# EAGLE design sensorAndTransmitter (EAGLE 8.0.2)
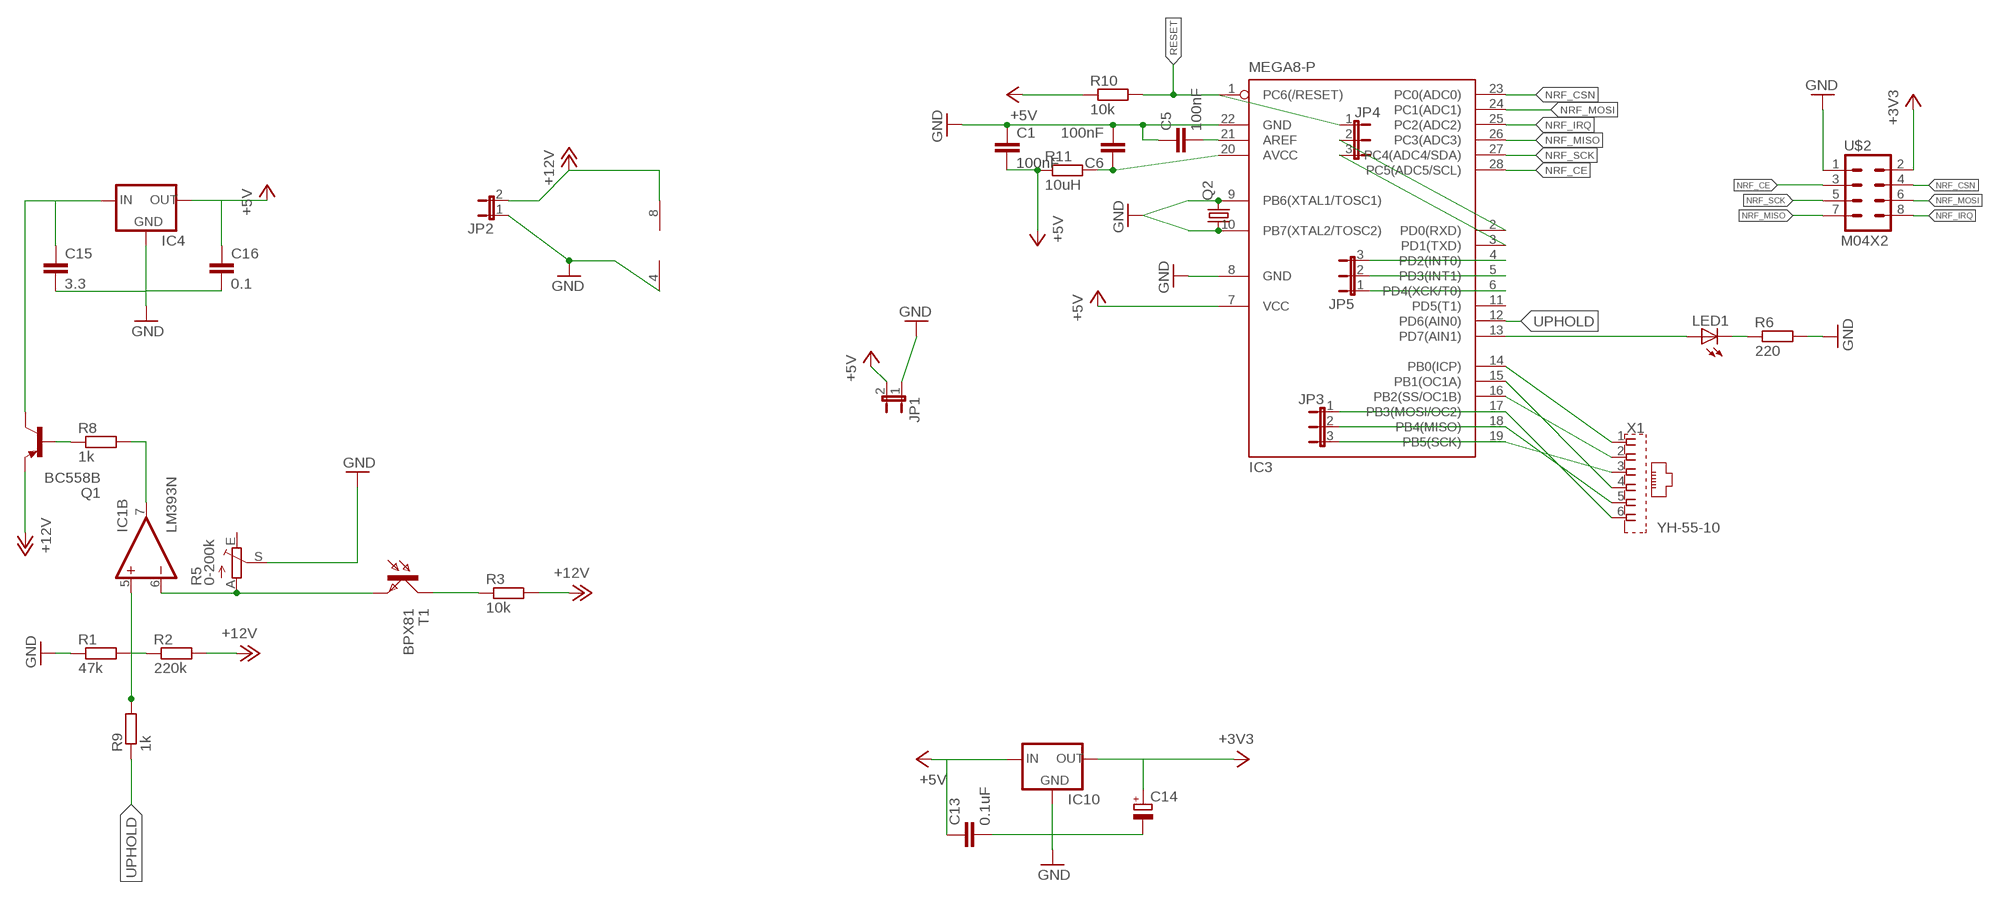
[diagram p0: schematic, sheet 1]

## Parts
C1  100nF  C2.5/2  [C2.5-2]
C5  100nF  C2.5/4  [C2.5-4]
C6  100nF  C5/2.5  [C5B2.5]
C13  0.1uF  C2.5/2  [C2.5-2]
C14  CPOL-EUE2.5-6  [E2,5-6]
C15  3.3  C-EU025-024X044  [C025-024X044]
C16  0.1  C-EU025-024X044  [C025-024X044]
IC1  LM393N  [DIL08]
IC3  MEGA8-P  [DIL28-3]
IC4  78XXL  [78XXL]
IC10  78XXL  [78XXL]
JP1  JP1E  [JP1]
JP2  JP1E  [JP1]
JP3  JP2E  [JP2]
JP4  JP2E  [JP2]
JP5  JP2E  [JP2]
LED1  LED3MM  [LED3MM]
Q1  BC558B  [TO92-EBC]
Q2  CRYSTALHC49S  [HC49/S]
R1  47k  R-EU_0204/5  [0204/5]
R2  220k  R-EU_0204/2V  [0204V]
R3  10k  R-EU_0204/5  [0204/5]
R5  0-200k  TRIM_EU-CA6V  [CA6V]
R6  220  R-EU_0204/2V  [0204V]
R8  1k  R-EU_0204/2V  [0204V]
R9  1k  R-EU_0204/7  [0204/7]
R10  10k  R-EU_0204/5  [0204/5]
R11  10uH  R-EU_V526-0  [V526-0]
T1  BPX81  [BPX81]
U$2  M04X2  [2X4]
X1  YH-55-10  [YH-55-10]

## Nets
+3V3: C14.+ IC10.OUT U$2.2
+5V: C1.2 C13.1 C16.1 IC3.7(VCC) IC4.OUT IC10.IN JP1.2 R10.1 R11.1
+12V: IC1.8(P:V+) JP2.2 Q1.E R2.2 R3.2
GND: C1.1 C5.1 C6.2 C13.2 C14.- C15.2 C16.2 IC1.4(P:V-) IC3.8(GND) IC3.22(GND) IC4.GND IC10.GND JP1.1 JP2.1 R1.1 R5.S R6.2 U$2.1
N$1: IC1.5(B:+IN) R1.2 R2.1 R9.2
N$2: R3.1 T1.C
N$3: IC1.6(B:-IN) R5.A T1.E
N$5: IC3.14(PB0(ICP)) X1.1
N$6: LED1.K(C) R6.1
N$7: IC3.13(PD7(AIN1)) LED1.A
N$8: IC3.15(PB1(OC1A)) X1.4
N$9: IC3.16(PB2(SS/OC1B)) X1.2
N$16: C5.2 IC3.21(AREF)
N$17: C6.1 IC3.20(AVCC) R11.2
N$59: IC3.9(PB6(XTAL1/TOSC1)) Q2.2
N$60: IC3.10(PB7(XTAL2/TOSC2)) Q2.1
N$61: IC3.2(PD0(RXD)) JP4.2
N$62: IC1.7(B:OUT) R8.2
N$63: C15.1 IC4.IN Q1.C
N$64: Q1.B R8.1
N$65: IC3.3(PD1(TXD)) JP4.3
N$66: IC3.4(PD2(INT0)) JP5.3
N$67: IC3.5(PD3(INT1)) JP5.2
N$68: IC3.6(PD4(XCK/T0)) JP5.1
NRF_CE: IC3.28(PC5(ADC5/SCL)) U$2.3
NRF_CSN: IC3.23(PC0(ADC0)) U$2.4
NRF_IRQ: IC3.25(PC2(ADC2)) U$2.8
NRF_MISO: IC3.26(PC3(ADC3)) U$2.7
NRF_MOSI: IC3.24(PC1(ADC1)) U$2.6
NRF_SCK: IC3.27(PC4(ADC4/SDA)) U$2.5
PB3: IC3.17(PB3(MOSI/OC2)) JP3.1 X1.6
PB4: IC3.18(PB4(MISO)) JP3.2 X1.5
PB5: IC3.19(PB5(SCK)) JP3.3 X1.3
RESET: IC3.1(PC6(/RESET)) JP4.1 R10.2
UPHOLD: IC3.12(PD6(AIN0)) R9.1
Unconnected: IC1.1(A:OUT) IC1.2(A:-IN) IC1.3(A:+IN) IC3.11(PD5(T1)) R5.E

## Library data of the parts
C1 C5 C6 C13 = capacitor-wima:C: CAPACITOR naming: grid - package width
C14 = resistor:CPOL-EU: POLARIZED CAPACITOR, European symbol
C15 C16 = rcl:C-EU: CAPACITOR, European symbol
IC1 = linear:LM393: COMPARATOR
IC3 = atmel:MEGA8-P: MICROCONTROLLER 8 Kbytes FLASH, 1 kbytes SRAM, 512 bytes EEPROM, USART, 4-channel 10 bit ADC, 2-channel 8 bit ADC Pin compatible with Atmega48, ATMega88, ATMega168 Source: avr.lbr; OC_FARNELL: unknown; OC_NEWARK: unknown
IC4 IC10 = v-reg:78XXL: VOLTAGE REGULATOR
JP1 JP2 = jumper:JP1E: JUMPER
JP3-JP5 = jumper:JP2E: JUMPER
LED1 = led:LED: LED OSRAM: - CHIPLED LG R971, LG N971, LY N971, LG Q971, LY Q971, LO R971, LY R971 LH N974, LH R974 LS Q976, LO Q976, LY Q976 LO Q996 - Hyper CHIPLED LW Q18S LB Q993, LB Q99A, LB R99A - SideLED LS A670, LO A670, LY A670, LG A670, LP A670 LB A673, LV A673, LT A673, LW A673 LH A674 LY A675 LS A676, LA A676, LO A676, LY A676, LW A676 LS A679, LY A679, LG A679 - Hyper Micro SIDELED® LS Y876, LA Y876, LO Y876, LY Y876 LT Y87S - SmartLED LW L88C, LW L88S LB L89C, LB L89S, LG L890 LS L89K, LO L89K, LY L89K LS L896, LA L896, LO L896, LY L896 - TOPLED LS T670, LO T670, LY T670, LG T670, LP T670 LSG T670, LSP T670, LSY T670, LOP T670, LYG T670 LG T671, LOG T671, LSG T671 LB T673, LV T673, LT T673, LW T673 LH T674 LS T676, LA T676, LO T676, LY T676, LB T676, LH T676, LSB T676, LW T676 LB T67C, LV T67C, LT T67C, LS T67K, LO T67K, LY T67K, LW E67C LS E67B, LA E67B, LO E67B, LY E67B, LB E67C, LV E67C, LT E67C LW T67C LS T679, LY T679, LG T679 LS T770, LO T770, LY T770, LG T770, LP T770 LB T773, LV T773, LT T773, LW T773 LH T774 LS E675, LA E675, LY E675, LS T675 LS T776, LA T776, LO T776, LY T776, LB T776 LHGB T686 LT T68C, LB T68C - Hyper Mini TOPLED® LB M676 - Mini TOPLED Santana® LG M470 LS M47K, LO M47K, LY M47K Source: http://www.osram.convergy.de LUXEON: - LUMILED® LXK2-PW12-R00, LXK2-PW12-S00, LXK2-PW14-U00, LXK2-PW14-V00 LXK2-PM12-R00, LXK2-PM12-S00, LXK2-PM14-U00 LXK2-PE12-Q00, LXK2-PE12-R00, LXK2-PE12-S00, LXK2-PE14-T00, LXK2-PE14-U00 LXK2-PB12-K00, LXK2-PB12-L00, LXK2-PB12-M00, LXK2-PB14-N00, LXK2-PB14-P00, LXK2-PB14-Q00 LXK2-PR12-L00, LXK2-PR12-M00, LXK2-PR14-Q00, LXK2-PR14-R00 LXK2-PD12-Q00, LXK2-PD12-R00, LXK2-PD12-S00 LXK2-PH12-R00, LXK2-PH12-S00 LXK2-PL12-P00, LXK2-PL12-Q00, LXK2-PL12-R00 Source: www.luxeon.com KINGBRIGHT: KA-3528ASYC Source: www.kingbright.com
Q1 = transistor-pnp:BC558*: PNP Transistror
Q2 = crystal:CRYSTAL: CRYSTAL; OC_FARNELL: 1667008; OC_NEWARK: unknown
R1-R3 R6 R8-R11 = resistor:R-EU_: RESISTOR, European symbol
R5 = pot:TRIM_EU-: POTENTIOMETER
T1 = opto-trans-siemens:BPX81: PHOTO TRANSISTOR; OC_FARNELL: unknown; OC_NEWARK: unknown
U$2 = SparkFun:M04X2
X1 = RJSajdak:YH-55-10: RJ11 6 connects Source: YH-55-10.pdf; OC_FARNELL: unknown; OC_NEWARK: unknown

## Net classes
0 default: clearance 0.205 mm

## Board
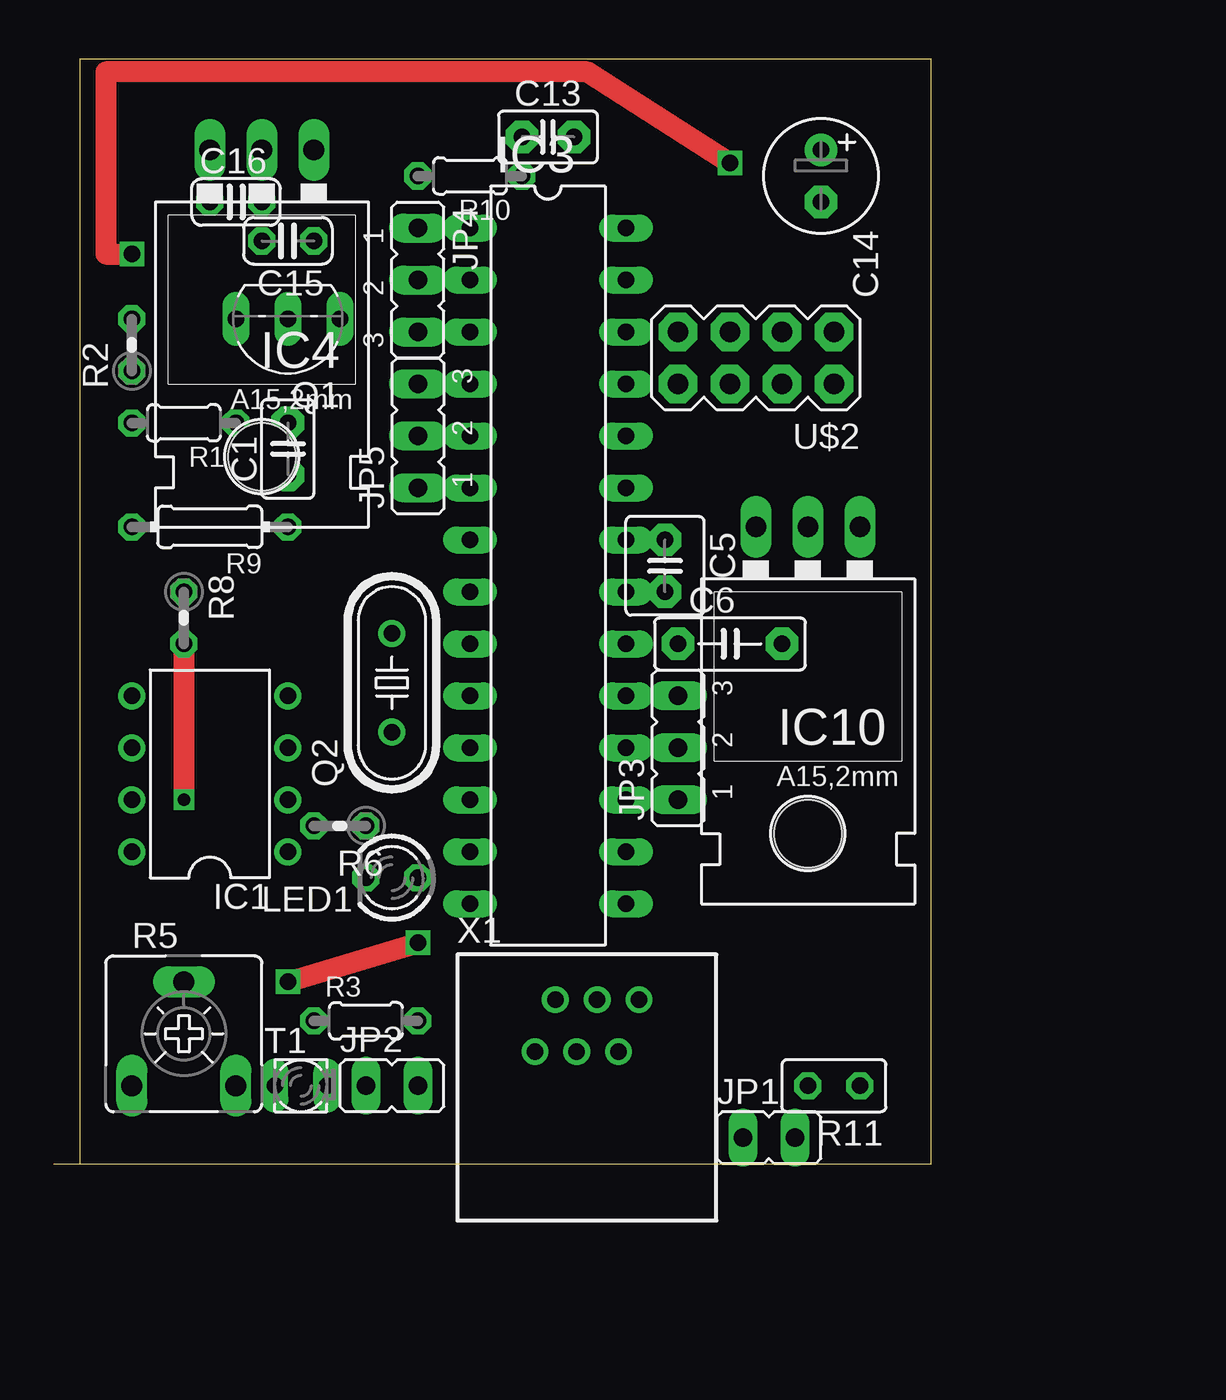
[diagram p1: board, top side]
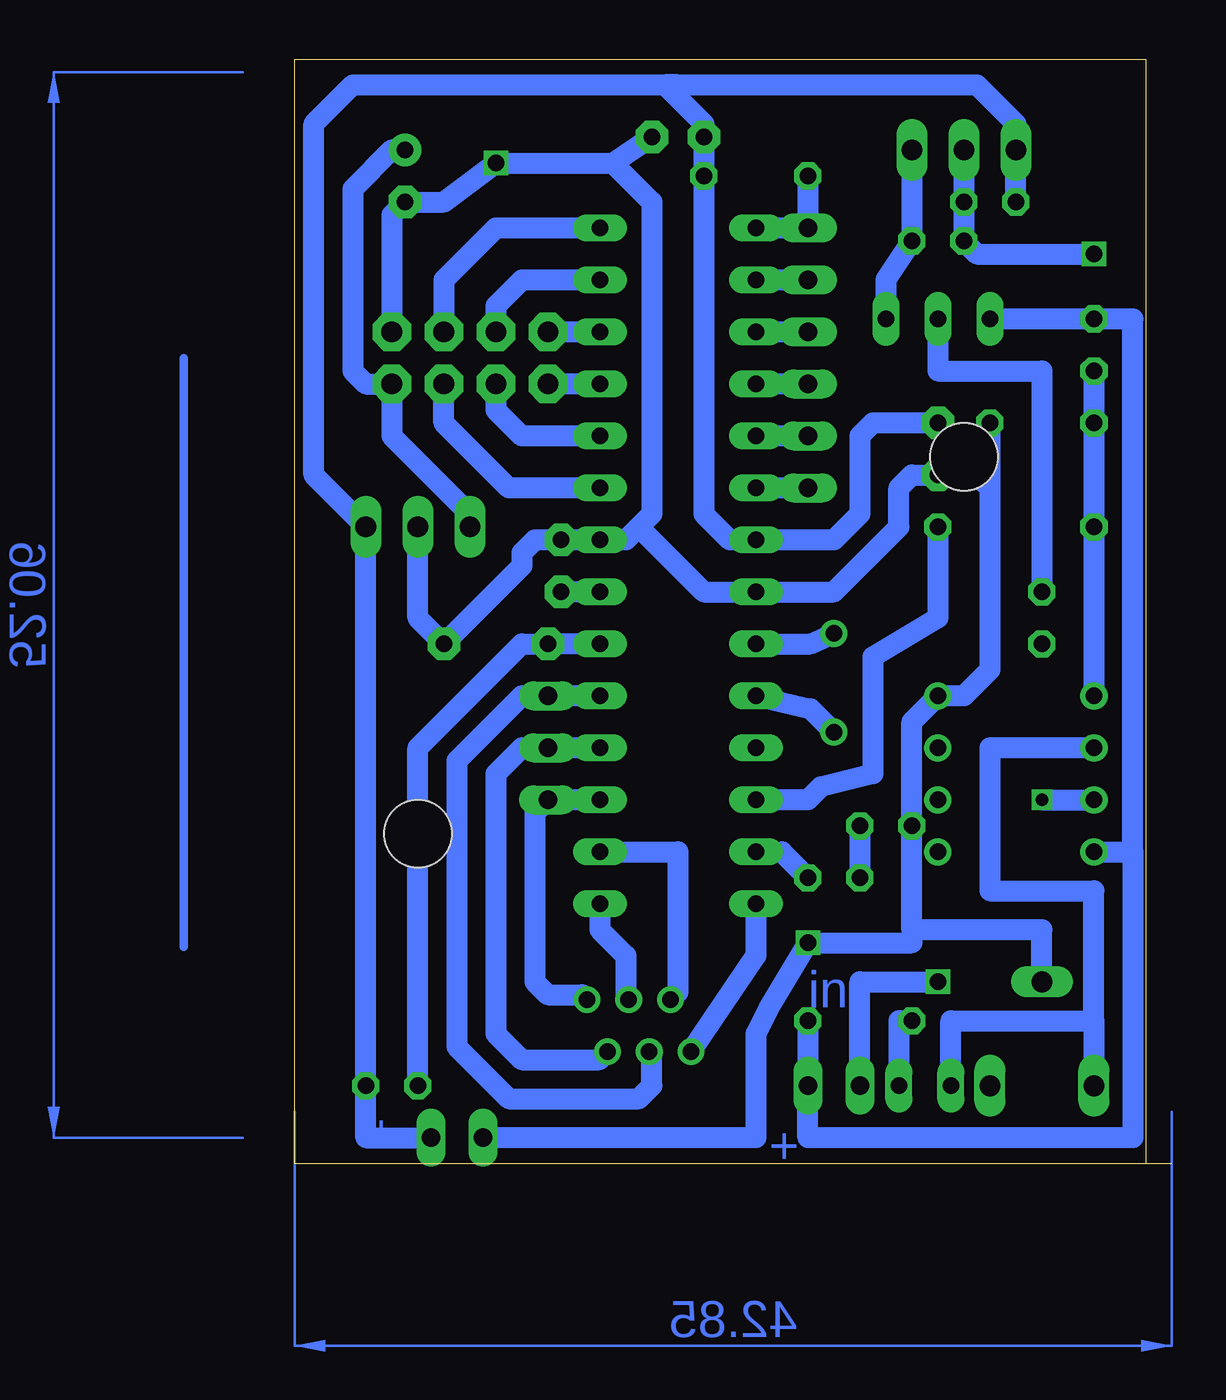
[diagram p2: board, bottom side, seen from below]

Size 42.85 x 53.96 mm. Coordinates in mm from the lower left corner, seen from the top.
Outline: 1.27,0 42.85,0 42.85,53.96 1.27,53.96 1.27,0
Outline: 0,0 1.27,0
Copper layers (1*16): Top 0.035mm / dielectric 1.5mm / Bottom 0.035mm
Design rules "default": minimum track width 10mil, minimum drill 24mil, track to track 8mil, track to pad 8mil, pad to pad 8mil, via to via 8mil, smd to smd 8mil, copper to edge 40mil, drill to drill 8mil, minimum pad ring 10mil, minimum via ring 8mil, stop-mask expansion 4mil, vias tented up to drill 0mil, thermal gap 10mil

### Footprints (pad centres in the part's own frame; a part is rotated, then mirrored left to right if it is on the bottom)
C2.5-2 = drill 0.813 pad 1.6 octagon: 1 -1.27,0; 2 1.27,0
C2.5-4 = drill 0.813 pad 1.6 octagon: 1 -1.27,0; 2 1.27,0
C5B2.5 = drill 0.813 pad 1.6 octagon: 1 -2.54,0; 2 2.54,0
E2,5-6 = drill 0.813 pad 1.6: + -1.27,0 | drill 0.813 pad 1.6 octagon: - 1.27,0
C025-024X044 = drill 0.813 octagon: 1 -1.27,0; 2 1.27,0
DIL08 = drill 0.813 pad 1.27: 1 -3.81,-3.81; 2 -1.27,-3.81; 3 1.27,-3.81; 4 3.81,-3.81; 5 3.81,3.81; 6 1.27,3.81; 7 -1.27,3.81; 8 -3.81,3.81
DIL28-3 = drill 0.813 long: 1 -16.51,-3.81; 2 -13.97,-3.81; 3 -11.43,-3.81; 4 -8.89,-3.81; 5 -6.35,-3.81; 6 -3.81,-3.81; 7 -1.27,-3.81; 8 1.27,-3.81; 9 3.81,-3.81; 10 6.35,-3.81; 11 8.89,-3.81; 12 11.43,-3.81; 13 13.97,-3.81; 14 16.51,-3.81; 15 16.51,3.81; 16 13.97,3.81; 17 11.43,3.81; 18 8.89,3.81; 19 6.35,3.81; 20 3.81,3.81; 21 1.27,3.81; 22 -1.27,3.81; 23 -3.81,3.81; 24 -6.35,3.81; 25 -8.89,3.81; 26 -11.43,3.81; 27 -13.97,3.81; 28 -16.51,3.81
78XXL = drill 1.016 long: GND 0,-3.81; IN -2.54,-3.81; OUT 2.54,-3.81 | hole 3.302: 0,11.176
JP1 = drill 0.914 long: 1 0,-1.27; 2 0,1.27
JP2 = drill 0.914 long: 1 -2.54,0; 2 0,0; 3 2.54,0
LED3MM = drill 0.813 octagon: A -1.27,0; K 1.27,0
TO92-EBC = drill 0.813 long: B 0,-1.27; C -2.54,-1.27; E 2.54,-1.27
HC49/S = drill 0.813: 1 -2.413,0; 2 2.413,0
0204/5 = drill 0.813 octagon: 1 -2.54,0; 2 2.54,0
0204V = drill 0.813 octagon: 1 -1.27,0; 2 1.27,0
CA6V = drill 1.016 long: A -2.54,-2.54; E 2.54,-2.54; S 0,2.54
0204/7 = drill 0.813 octagon: 1 -3.81,0; 2 3.81,0
V526-0 = drill 0.813 octagon: 1 -1.27,0; 2 1.27,0
BPX81 = drill 0.813 long: C 1.27,0; E -1.27,0
2X4 = drill 1.016 pad 1.88 octagon: 1 -3.81,-1.27; 2 -3.81,1.27; 3 -1.27,-1.27; 4 -1.27,1.27; 5 1.27,-1.27; 6 1.27,1.27; 7 3.81,-1.27; 8 3.81,1.27
YH-55-10 = drill 0.8 pad 1.3: 1 -2.54,2.3; 2 -1.54,4.84; 3 -0.5,2.3; 4 0.5,4.84; 5 1.54,2.3; 6 2.54,4.84

### Placement (x,y rotation side)
C1  11.43,34.93 90 top
C5  29.84,29.21 270 top
C6  33.02,25.4 0 top
C13  24.13,50.16 0 top
C14  37.47,48.26 270 top
C15  11.43,45.09 180 top
C16  8.89,46.99 0 top
IC1  7.62,19.05 90 top
IC3  24.13,29.21 270 top
IC4  10.16,45.72 180 top
IC10  36.83,27.3 180 top
JP1  34.93,1.27 270 top
JP2  16.51,3.81 270 top
JP3  30.48,20.32 90 top
JP4  17.78,43.18 270 top
JP5  17.78,35.56 90 top
LED1  16.51,13.97 180 top
Q1  11.43,40.01 180 top
Q2  16.51,23.5 90 top
R1  6.35,36.2 180 top
R2  3.81,40.01 90 top
R3  15.24,6.98 0 top
R5  6.35,6.35 0 top
R6  13.97,16.51 180 top
R8  6.35,26.67 270 top
R9  7.62,31.12 180 top
R10  20.32,48.26 180 top
R11  38.1,3.81 180 top
T1  12.07,3.81 0 top
U$2  34.29,39.37 180 top
X1  26.04,3.18 0 top

### Tracks (layer width: path | path; a pad name or v marks a point on that pad's centre or on a via)
+3V3
  Bottom 1.016: IC10.OUT 34.29,31.75 38.1,35.56 U$2.2 39.37,38.1 40.01,38.74 40.01,47.63 38.1,49.53 C14.+
+5V
  Bottom 1.016: C1.2 14.61,36.2 15.24,35.56 15.24,31.75 16.51,30.48 IC3.7 21.59,30.48 22.86,31.75 R10.1 C13.1 22.86,50.8 24.77,52.71 24.13,52.71 | C16.1 IC4.OUT 7.62,50.8 9.52,52.71 24.13,52.71 | JP1.2 39.37,1.27 R11.1 IC10.IN 41.91,33.66 41.91,50.8 40.01,52.71 24.13,52.71
+12V
  Bottom 1.016: 1.91,15.24 1.91,1.27 17.78,1.27 JP2.2 R3.2 | 1.91,15.24 1.91,41.27 R2.2 Q1.E | IC1.8 1.91,15.24
GND  (via drill 0.8)
  Top 1.016: v33.02,48.9 26.04,53.34 2.54,53.34 2.54,44.45 v3.81,44.45 | v11.43,8.89 v17.78,10.8
  Bottom 1.016: 26.04,31.12 26.67,30.48 IC3.22 C5.1 31.12,30.48 31.75,29.84 31.75,29.21 C6.2 36.83,26.67 IC10.GND 36.83,30.48 | 26.04,31.12 25.4,31.75 25.4,46.99 27.3,48.9 | 26.04,31.12 22.86,27.94 IC3.8 16.51,27.94 13.34,31.12 13.34,33.02 12.7,33.66 C1.1 9.52,33.66 8.89,33.02 | C13.2 27.3,48.9 | R1.1 8.89,33.02 | 8.89,33.02 8.89,24.13 10.16,22.86 IC1.4 12.7,21.59 R6.2 12.7,11.43 | 27.3,48.9 v33.02,48.9 35.56,46.99 C14.- 38.1,46.35 U$2.1 | IC4.GND C16.2 C15.2 9.52,44.45 v3.81,44.45 | JP2.1 15.24,8.89 v11.43,8.89 | JP1.1 20.32,1.27 20.32,6.35 19.69,7.62 v17.78,10.8 12.7,10.8 12.7,11.43 | R5.S 6.35,11.43 12.7,11.43
N$1
  Bottom 1.016: R2.1 R1.2 R9.2 IC1.5
N$2
  Bottom 1.016: R3.1 13.34,6.98 T1.C
N$3
  Bottom 1.016: IC1.6 8.89,20.32 8.89,13.34 3.81,13.34 3.81,6.98 | 3.81,6.98 R5.A | T1.E 10.8,6.98 3.81,6.98
N$5
  Bottom 1.016: IC3.14 20.32,10.16 X1.1
N$6
  Bottom 1.016: R6.1 LED1.K
N$7
  Bottom 1.016: IC3.13 19.05,15.24 LED1.A
N$8
  Bottom 1.016: IC3.15 27.94,11.43 26.67,10.16 26.67,8.15 X1.4
N$9
  Bottom 1.016: IC3.16 24.13,15.24 24.13,8.38 X1.2
N$11
  Bottom 0.406: 48.26,39.37 48.26,10.6
N$16
  Bottom 1.016: IC3.21 C5.2
N$17
  Bottom 1.016: IC3.20 C6.1 31.75,25.4 36.83,20.32 R11.2
N$59
  Bottom 1.016: IC3.9 17.65,25.4 Q2.2
N$60
  Bottom 1.016: IC3.10 17.65,22.23 Q2.1
N$61
  Bottom 1.016: JP4.2 IC3.2
N$62  (via drill 0.6)
  Top 1.016: R8.2 v6.35,17.78
  Bottom 1.016: v6.35,17.78 IC1.7
N$63
  Bottom 1.016: IC4.IN C15.1 13.97,43.18 Q1.C
N$64
  Bottom 1.016: Q1.B 11.43,38.74 6.35,38.74 R8.1
N$65
  Bottom 1.016: JP4.3 IC3.3
N$66
  Bottom 1.016: JP5.3 IC3.4
N$67
  Bottom 1.016: JP5.2 IC3.5
N$68
  Bottom 1.016: JP5.1 IC3.6
NRF_CE
  Bottom 1.016: IC3.28 33.02,45.72 35.56,43.18 U$2.3
NRF_CSN
  Bottom 1.016: IC3.23 32.38,33.02 35.56,36.2 U$2.4
NRF_IRQ
  Bottom 1.016: IC3.25 U$2.8
NRF_MISO
  Bottom 1.016: IC3.26 U$2.7
NRF_MOSI
  Bottom 1.016: IC3.24 31.75,35.56 33.02,36.83 U$2.6
NRF_SCK
  Bottom 1.016: IC3.27 31.75,43.18 33.02,41.91 U$2.5
PB3
  Bottom 1.016: IC3.17 JP3.1 31.12,17.15 31.12,8.89 30.48,8.26 28.82,8.26 X1.6
PB4
  Bottom 1.016: IC3.18 JP3.2 31.75,20.32 33.02,19.05 33.02,6.35 31.75,5.08 27.97,5.08 X1.5
PB5
  Bottom 1.016: IC3.19 JP3.3 31.75,22.86 34.93,19.69 34.93,5.71 32.38,3.18 26.04,3.18 25.4,3.81 25.4,5.34 X1.3
RESET
  Bottom 1.016: IC3.1 JP4.1 R10.2
UPHOLD
  Bottom 1.016: R9.1 11.43,26.67 14.61,24.77 14.61,19.05 17.15,18.41 17.78,17.78 IC3.12
(copper drawn outside any net)
  shapes: Bottom area x2

### Text on the board
Bottom: Reverse Parking 1.1 | SAJDAK IT | in | + | + | +